# Altium project RP2040KB Rev B.PrjPcb
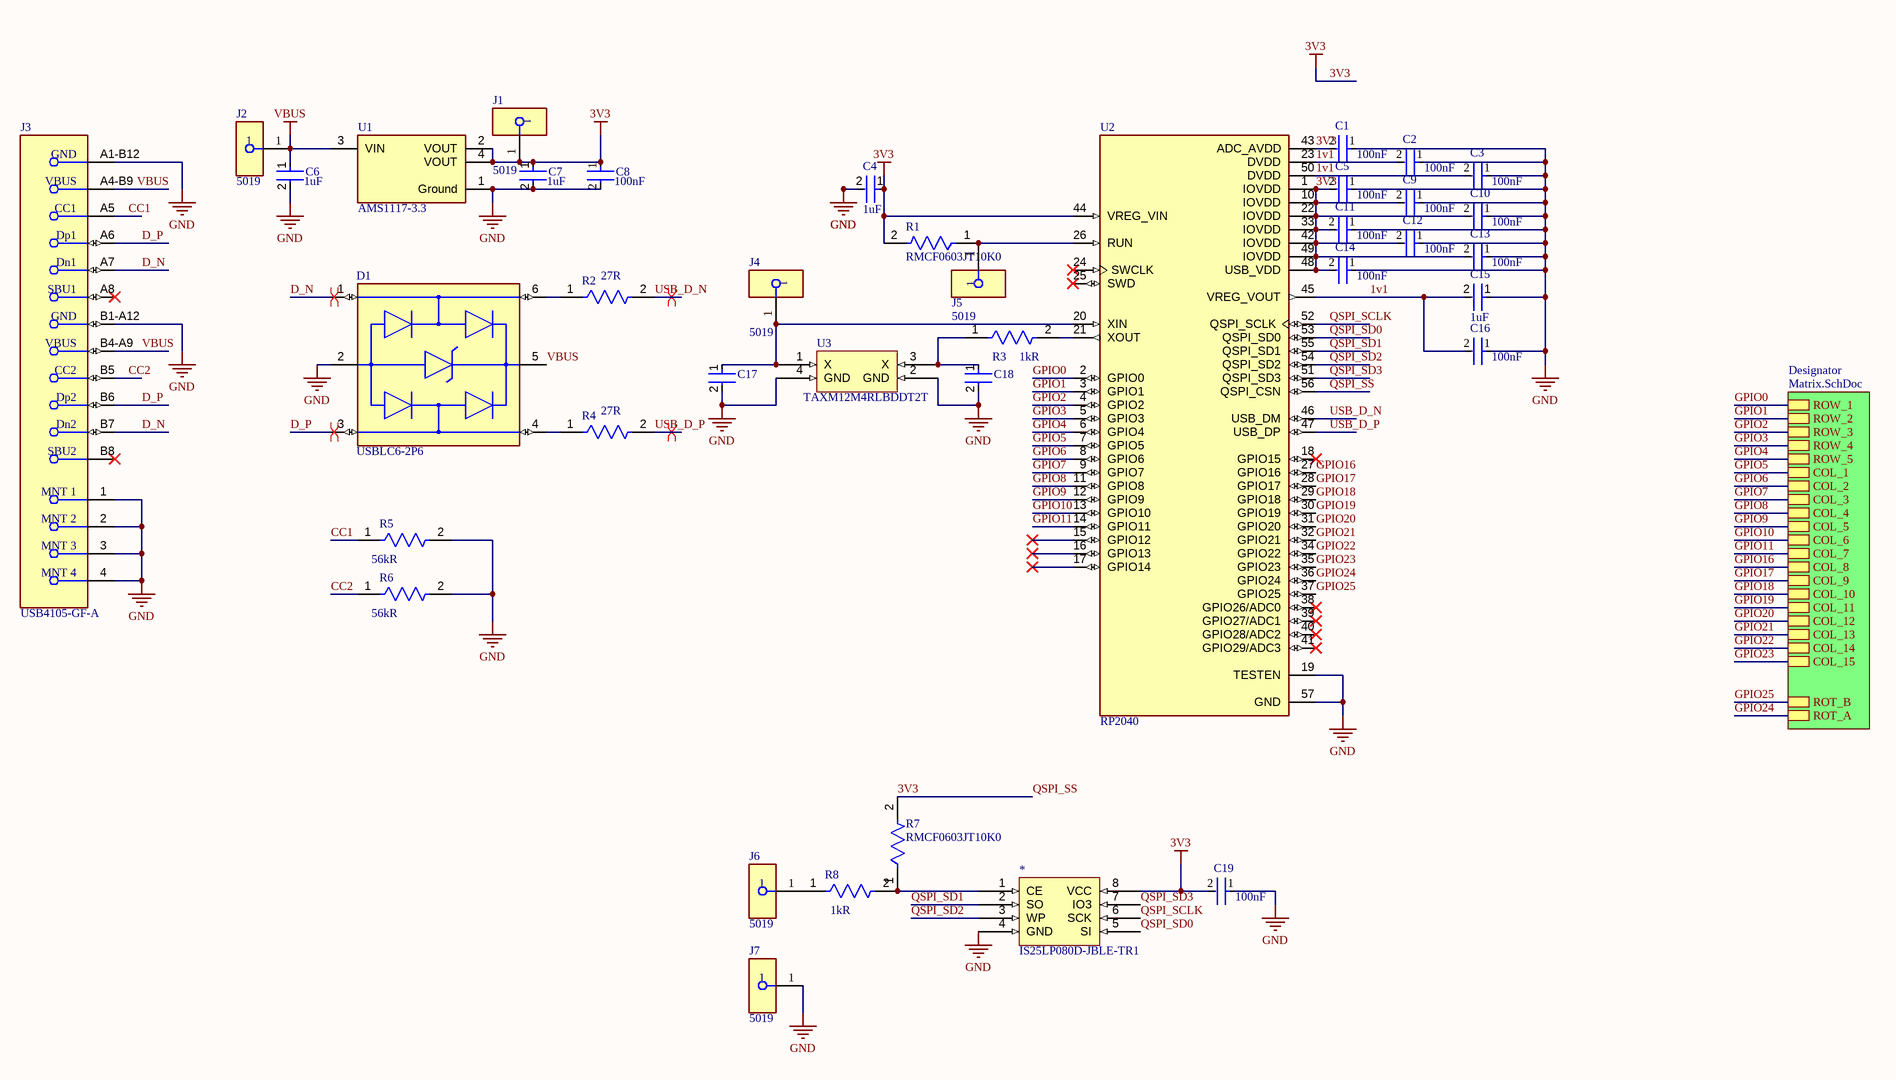
[diagram p0: Keyboard.SchDoc]
2 sheets, 179 parts. Net scope: hierarchical (ports join the sheet entries above them; power ports are global).
Board file: Layout.PcbDoc
Sheets:
  Keyboard.SchDoc
    Designator = Matrix.SchDoc

## Sheet Keyboard.SchDoc
size 431 x 279 mm; SheetNumber: 1; SheetTotal: 1

### Parts
*  IS25LP080D-JBLE-TR1  [SOIC127P1030X265-8N]
C1  Capacitance: 100nF  [FP-GRM155-0_05-MFG]  (hidden comment: GRM155R71C104KA88J)
C2  Capacitance: 100nF  [FP-GRM155-0_05-MFG]  (hidden comment: GRM155R71C104KA88J)
C3  Capacitance: 100nF  [FP-GRM155-0_05-MFG]  (hidden comment: GRM155R71C104KA88J)
C4  Capacitance: 1uF  [FP-CL10-IPC_A]  (hidden comment: CL10A105KO8NNNC)
C5  Capacitance: 100nF  [FP-GRM155-0_05-MFG]  (hidden comment: GRM155R71C104KA88J)
C6  Capacitance: 1uF  [FP-CL10-IPC_A]  (hidden comment: CL10A105KO8NNNC)
C7  Capacitance: 1uF  [FP-CL10-IPC_A]  (hidden comment: CL10A105KO8NNNC)
C8  Capacitance: 100nF  [FP-GRM155-0_05-MFG]  (hidden comment: GRM155R71C104KA88J)
C9  Capacitance: 100nF  [FP-GRM155-0_05-MFG]  (hidden comment: GRM155R71C104KA88J)
C10  Capacitance: 100nF  [FP-GRM155-0_05-MFG]  (hidden comment: GRM155R71C104KA88J)
C11  Capacitance: 100nF  [FP-GRM155-0_05-MFG]  (hidden comment: GRM155R71C104KA88J)
C12  Capacitance: 100nF  [FP-GRM155-0_05-MFG]  (hidden comment: GRM155R71C104KA88J)
C13  Capacitance: 100nF  [FP-GRM155-0_05-MFG]  (hidden comment: GRM155R71C104KA88J)
C14  Capacitance: 100nF  [FP-GRM155-0_05-MFG]  (hidden comment: GRM155R71C104KA88J)
C15  Capacitance: 1uF  [FP-CL10-IPC_A]  (hidden comment: CL10A105KO8NNNC)
C16  Capacitance: 100nF  [FP-GRM155-0_05-MFG]  (hidden comment: GRM155R71C104KA88J)
C17  GQM2195C2E320JB12D  [FP-GQM219-0_15-IPC_C]  (value not drawn)
C18  GQM2195C2E320JB12D  [FP-GQM219-0_15-IPC_C]  (value not drawn)
C19  Capacitance: 100nF  [FP-GRM155-0_05-MFG]  (hidden comment: GRM155R71C104KA88J)
D1  USBLC6-2P6  [FP-SOT-666-MFG]
J1  5019  [FP-5019-MFG]
J2  5019  [FP-5019-MFG]
J3  USB4105-GF-A  [FP-USB4105-GF-A-MFG]
J4  5019  [FP-5019-MFG]
J5  5019  [FP-5019-MFG]
J6  5019  [FP-5019-MFG]
J7  5019  [FP-5019-MFG]
R1  RMCF0603JT10K0  [FP-RMCF0603-IPC_C]
R2  Resistance: 27R  [FP-RMCF0603-IPC_B]  (hidden comment: RMCF0603FT27R0)
R3  Resistance: 1kR  [FP-RC0603-0_55-IPC_C]  (hidden comment: RC0603FR-071KL)
R4  Resistance: 27R  [FP-RMCF0603-IPC_B]  (hidden comment: RMCF0603FT27R0)
R5  Resistance: 56kR  [FP-RMCF1206-MFG]  (hidden comment: RMCF1206JT56K0)
R6  Resistance: 56kR  [FP-RMCF1206-MFG]  (hidden comment: RMCF1206JT56K0)
R7  RMCF0603JT10K0  [FP-RMCF0603-IPC_C]
R8  Resistance: 1kR  [FP-RC0603-0_55-IPC_C]  (hidden comment: RC0603FR-071KL)
U1  AMS1117-3.3  [FP-AMS1117-IPC_C]
U2  RP2040  [QFN40P700X700X90-57N]
U3  TAXM12M4RLBDDT2T  [TAXM12M4RLBDDT2T]

### Sub-sheets
Designator = Matrix.SchDoc: ROW_1, ROW_2, ROW_3, ROW_4, ROW_5, COL_1, COL_2, COL_3, COL_4, COL_5, COL_6, COL_7, COL_8, COL_9, COL_10, COL_11, COL_12, COL_13, COL_14, COL_15, ROT_B, ROT_A

### Nets
3V3: *.8(VCC) C1.2 C4.1 C5.2 C7.1 C8.1 C9.2 C10.2 C11.2 C12.2 C13.2 C14.2 C19.2 J1.1 R1.2 R7.2 U1.2(VOUT) U1.4(VOUT) U2.1(IOVDD) U2.10(IOVDD) U2.22(IOVDD) U2.33(IOVDD) U2.42(IOVDD) U2.43(ADC_AVDD) U2.44(VREG_VIN) U2.48(USB_VDD) U2.49(IOVDD) U2.56(QSPI_CSN)  [also labelled QSPI_SS]
GND: *.4(GND) C1.1 C2.1 C3.1 C4.2 C5.1 C6.2 C7.2 C8.2 C9.1 C10.1 C11.1 C12.1 C13.1 C14.1 C15.1 C16.1 C17.2 C18.2 C19.1 D1.2(GND) J3.1(MNT_1) J3.2(MNT_2) J3.3(MNT_3) J3.4(MNT_4) J3.A1-B12(GND) J3.B1-A12(GND) J7.1 R5.2 R6.2 U1.1(Ground) U2.19(TESTEN) U2.57(GND) U3.2(GND) U3.4(GND)
VBUS: C6.1 D1.5(VBUS) J2.1 J3.A4-B9(VBUS) J3.B4-A9(VBUS) U1.3(VIN)
1v1: C2.2 C3.2 C15.2 C16.2 U2.23(DVDD) U2.45(VREG_VOUT) U2.50(DVDD)
CC1: J3.A5(CC1) R5.1
CC2: J3.B5(CC2) R6.1
D_N: D1.1(I/O1) J3.A7(Dn1) J3.B7(Dn2)
D_P: D1.3(I/O2) J3.A6(Dp1) J3.B6(Dp2)
GPIO0: U2.2(GPIO0) ; sheet Designator/ROW_1
GPIO1: U2.3(GPIO1) ; sheet Designator/ROW_2
GPIO2: U2.4(GPIO2) ; sheet Designator/ROW_3
GPIO3: U2.5(GPIO3) ; sheet Designator/ROW_4
GPIO4: U2.6(GPIO4) ; sheet Designator/ROW_5
GPIO5: U2.7(GPIO5) ; sheet Designator/COL_1
GPIO6: U2.8(GPIO6) ; sheet Designator/COL_2
GPIO7: U2.9(GPIO7) ; sheet Designator/COL_3
GPIO8: U2.11(GPIO8) ; sheet Designator/COL_4
GPIO9: U2.12(GPIO9) ; sheet Designator/COL_5
GPIO10: U2.13(GPIO10) ; sheet Designator/COL_6
GPIO11: U2.14(GPIO11) ; sheet Designator/COL_7
GPIO16: U2.27(GPIO16) ; sheet Designator/COL_8
GPIO17: U2.28(GPIO17) ; sheet Designator/COL_9
GPIO18: U2.29(GPIO18) ; sheet Designator/COL_10
GPIO19: U2.30(GPIO19) ; sheet Designator/COL_11
GPIO20: U2.31(GPIO20) ; sheet Designator/COL_12
GPIO21: U2.32(GPIO21) ; sheet Designator/COL_13
GPIO22: U2.34(GPIO22) ; sheet Designator/COL_14
GPIO23: U2.35(GPIO23) ; sheet Designator/COL_15  [project net COL_15]
GPIO24: U2.36(GPIO24) ; sheet Designator/ROT_A
GPIO25: U2.37(GPIO25) ; sheet Designator/ROT_B
QSPI_SCLK: *.6(SCK) U2.52(QSPI_SCLK)
QSPI_SD0: *.5(SI) U2.53(QSPI_SD0)
QSPI_SD1: *.2(SO) U2.55(QSPI_SD1)
QSPI_SD2: *.3(WP) U2.54(QSPI_SD2)
QSPI_SD3: *.7(IO3) U2.51(QSPI_SD3)
USB_D_N: R2.2 U2.46(USB_DM)
USB_D_P: R4.2 U2.47(USB_DP)
Net*_1: *.1(CE) R7.1 R8.2
NetC17_1: C17.1 J4.1 U2.20(XIN) U3.1(X)
NetC18_1: C18.1 R3.1 U3.3(X)
NetD1_4: D1.4(I/O2) R4.1
NetD1_6: D1.6(I/O1) R2.1
NetJ5_1: J5.1 R1.1 U2.26(RUN)
NetJ6_1: J6.1 R8.1
NetR3_2: R3.2 U2.21(XOUT)

Not connected (* = marked no-connect by the designer): J3 A8(SBU1)* B8(SBU2)*; U2 15(GPIO12)* 16(GPIO13)* 17(GPIO14)* 18(GPIO15)* 24(SWCLK)* 25(SWD)* 38(GPIO26/ADC0)* 39(GPIO27/ADC1)* 40(GPIO28/ADC2)* 41(GPIO29/ADC3)*

### Layout directives
differential pair: D_N, D_P, USB_D_N, USB_D_P

### Notes on the sheet
- DWG. NO.
- REV.
- SHT.
- THIS DOCUMENT AND THE DATA DISCLOSED HEREIN OR HEREWITH IS THE PROPERTY OF ALTIUM LIMITED AND MAY BE FREELY DISTRIBUTED IN WHOLE. NO RIGHTS ARE RESERVED OR EXPRESS OR IMPLIED WARANTEE GIVEN.
- REVISION
- DESCRIPTION
- DATE
- APPROVED
- ENG:
- APPROVALS
- PROJECT
- DSN:
- CHK:
- REFERENCE DOCUMENTS
- PROJECT REVISION:
- TITLE
- DOCUMENT REVISION:
- DESIGN ITEM:
- BOM:
- FAB DWG:
- PCB DWG:
- ASSY DWG:
- SCALE:
- SIZE
- B
- CAGE CODE
- FILE NAME
- DWG NO.
- SHEET
- OF
- REV

### Library data of the parts
* = CMP-002-00077-1: Flash
C1-C3 C5 C8-C14 C16 C19 = CMP-2008-03928-2: NexarPartId: 9223238; Manufacturer Lifecycle Status: NRND; Voltage: 16V; Tolerance: 10%; Dielectric: X7R; Material: Ceramic; Schedule B: 8532240020, 8532240020; Mount: Surface Mount; Case/Package: 0402; Case Code (Imperial): 0402; Min Operating Temperature: -55°C; Length: 1mm; Voltage Rating (DC): 16V; Depth: 500µm; Lead Free: Lead Free; Max Operating Temperature: 125°C; Case Code (Metric): 1005; Radiation Hardening: No; Height: 550µm; Voltage Rating: 16V; Packaging: Cut Tape; RoHS: Compliant; Width: 500µm; Number of Pins: 2; REACH SVHC: No SVHC; Termination: SMD/SMT; Thickness: 500µm
C4 C6 C7 C15 = CMP-13271-001457-1: Cap Ceramic 1uF 16V X5R ±10% Pad SMD 0603 +85°C T/R; Dielectric: X5R; Height: 0.8mm; Mount: Surface Mount; Thickness: 0.035inch; Width: 0.031inch; Min Operating Temperature: -55°C; Contact Plating: Tin; Case Code (Imperial): 0603; Depth: 0.8mm; Length: 1.6mm; Max Operating Temperature: 85°C; Packaging: Tape and Reel; Tolerance: 10%; Radiation Hardening: No; Case/Package: 0603; Package Quantity: 1; Voltage Rating: 16V; Case Code (Metric): 1608; Voltage: 16V; Material: Ceramic; Lead Free: Lead Free; Voltage Rating (DC): 16V
C17 C18 = CMP-06035-016346-1: Ceramic Capacitor 32pF ±5% 250VDC C0G 0805 Paper T/R
D1 = CMP-12225-000058-1: TVS DIODE 5.25V 17V SOT666; Min Breakdown Voltage: 6V; Power Line Protection: Yes; Element Configuration: Dual; Test Current: 1mA; Working Voltage: 5V; Number of Channels: 2; Max Reverse Leakage Current: 150nA; Direction: Unidirectional; Peak Pulse Current: 5A; Number of Elements: 1; Capacitance: 3.5pF; Max Breakdown Voltage: 6V; Height: 0.6mm; Depth: 1.3mm; Contact Plating: Tin; Reverse Breakdown Voltage: 6V; REACH SVHC: No SVHC; Operating Supply Voltage: 5V; Width: 1.3mm; Max Operating Temperature: 125°C; Reverse Standoff Voltage: 5V; ESD Protection: Yes; Package Quantity: 1; Termination: SMD/SMT; Length: 1.7mm; Leakage Current: 150nA; Number of Bidirectional Channels: 2; Case/Package: SOT-666; Min Operating Temperature: -40°C; Number of Pins: 6; Clamping Voltage: 17V; Breakdown Voltage: 6V; Lead Free: Lead Free; Radiation Hardening: No; Packaging: Tape and Reel; Mount: Surface Mount; Polarity: Unidirectional
J1 J2 J4-J7 = CMP-1672-00008-2: NexarPartId: 22052288; Number of Contacts: 1; Contact Material: Bronze, Silver; Number of Pins: 1; Lead Free: Lead Free; Packaging: Tape and Reel; Mount: Surface Mount; Height: 2.286mm; Contact Plating: Silver; Material: Bronze; Termination: SMD/SMT; REACH SVHC: No SVHC; RoHS: Compliant
J3 = CMP-245163-000001-1: CONN RCPT USB2.0 TYPEC 5A; Manufacturer: GCT; Voltage Rating: 20V; Is Female: yes; Current Rating: 5/6.25/1.25/0.25A; Number Of Contacts: 16; Conn Orientation: Right Angle; Device Class L1: Connectors; Category: Conn; Lead Free: Yes; RoHS: TRUE; Temperature Range High: +85°C; Digikey Description: CONN RCPT USB2.0 TYPEC 5A; Device Class L3: unset; ComponentLink2Description: Datasheet; Manufacturer Part Number: USB4105-GF-A; Package: 0; Usb Standard: USB 2.0; Device Class L2: USB Connectors; Automotive: No; Temperature Range Low: -40°C; Height: 3.46mm; Temperature: -40°C to +85°C; Contact Material: Gold,Nickel; ComponentLink2URL: https://gct.co/files/drawings/usb4105.pdf; Octopart: https://octopart.com/usb4105-gf-a-gct-106627878
R1 R7 = CMP-26527-002098-1: 10kΩ ±5% 0.1W 0603 Thick Film Chip Resistor AEC-Q200 compliant; Power Rating: 100mW; Temperature Coefficient: 100ppm/°C; Resistance: 10kR; Radiation Hardening: No; Military Standard: Not; Mount: Surface Mount; Resistor Type: Thick Film; Size Code: 0603; Case/Package: 0603; Min Operating Temperature: -55°C; Construction: Rectangular; Series: RMCF; Width: 0.031inch; Length: 1.55mm; Case Code (Metric): 1608; Depth: 0.8mm; Height: 0.022inch; Packaging: Tape and Reel; Lead Free: Lead Free; Tolerance: 5%; Case Code (Imperial): 0603; Max Operating Temperature: 155°C; Contact Plating: Tin; Max Power Dissipation: 100mW; Features: Automotive AEC-Q200; Number of Terminations: 2
R2 R4 = CMP-26527-005743-1: 27Ω ±1% 0.1W 0603 Thick Film Chip Resistor AEC-Q200 compliant; Max Power Dissipation: 100mW; Temperature Coefficient: 100ppm/°C; Case/Package: 0603; Contact Plating: Tin; Packaging: Tape and Reel; Length: 0.061inch; Radiation Hardening: No; Mount: Surface Mount; Series: RMCF; Min Operating Temperature: -55°C; Lead Free: Lead Free; Width: 0.031inch; Resistor Type: Thick Film; Max Operating Temperature: 155°C; RoHS Compliant: Yes; Case Code (Imperial): 0603; Height: 0.022inch; Number of Terminations: 2; Case Code (Metric): 1608; Tolerance: 1%; Features: Automotive AEC-Q200
R3 R8 = CMP-1659-00009-5: RES 1K OHM 1% 1/10W 0603; Voltage Rating: 50V; Power Rating: 100mW; Temperature Coefficient: 100ppm/°C; Military Standard: Not; REACH SVHC: No SVHC; Size Code: 0603; Features: Moisture Resistant; Number of Terminations: 2; Technology: THICK FILM; Series: RC; Case Code (Metric): 1608; Resistance Tolerance: 1%; Resistor Type: Thick Film; Termination: SMD/SMT; Contact Plating: Tin; Radiation Hardening: No; Min Operating Temperature: -55°C; Max Operating Temperature: 155°C; Packaging: Tape and Reel; Max Power Dissipation: 100mW; RoHS Compliant: Yes; Height: 0.45mm; Lead Free: Lead Free; Case/Package: 0603; Length: 1.6mm; Tolerance: 1%; Case Code (Imperial): 0603; Construction: Rectangular; Depth: 0.8mm
R5 R6 = CMP-26527-003341-1: 56kΩ ±5% 0.25W 1206 Thick Film Chip Resistor AEC-Q200 compliant; Max Power Dissipation: 250mW; Temperature Coefficient: 200ppm/°C; RoHS Compliant: Yes; Number of Terminations: 2; Max Operating Temperature: 155°C; Case/Package: 1206; Case Code (Imperial): 1206; Length: 0.126inch; Size Code: 1206; Height: 0.028inch; Resistor Type: Thick Film; Width: 0.063inch; Power Rating: 250mW; Contact Plating: Tin; Min Operating Temperature: -55°C; Features: Automotive AEC-Q200; Military Standard: Not; Mount: Surface Mount; Depth: 1.6mm; Tolerance: 5%; Lead Free: Lead Free; Packaging: Tape and Reel; Construction: Rectangular; Radiation Hardening: No; Case Code (Metric): 3216; Series: RMCF
U1 = CMP-209535-000001-1: LDO Voltage Regulators 1A, 3.3V; Manufacturer: Advanced Monolithic Systems; Dropout Voltage: 1.1V; Output Type: Fixed; Nominal Supply Current: 5mA; Max Power Dissipation: 1.2W; Max Supply Voltage: 15V; Number Of Outputs: 1; Standoff Height: 0.64mm; Max Junction Temp: +125°C; Height: 1.8mm; Package: AMS1117; Device Class L2: Power Management ICs; ComponentLink2Description: Datasheet; ComponentLink2URL: http://www.advanced-monolithic.com/pdf/ds1117.pdf; Category: IC; RoHS: TRUE; Automotive: No; Device Class L1: Integrated Circuits (ICs); Output Current: 1A; Device Class L3: Voltage Regulators - Linear; Temperature: -40°C to +125°C; Output Voltage: 3.3V; Manufacturer Part Number: AMS1117-3.3; Temperature Range Low: -40°C; Octopart: https://octopart.com/ams1117-3.3-advanced+monolithic+systems-25899300; Lead Free: Yes; Ipc Land Pattern Name: SOT229P700X180-4; Temperature Range High: +125°C
U2 = CMP-027-000000-1: RP2040 chip for Raspberry Pi Pico - ARM® Cortex®-M0+ MCU 32-Bit; MP: RP2040; Design Item ID: RP2040; SnapEDA_Link: https://www.snapeda.com/parts/RP2040/Raspberry+Pi/view-part/?ref=snap; Source: RP2040.SchLib; Pin Count: 57; Value: *; Component Type: Standard; MF: Raspberry Pi; Package: None; Check_prices: https://www.snapeda.com/parts/RP2040/Raspberry+Pi/view-part/?ref=eda
U3 = CMP-00000-1: Crystal 12MHz; Load Capacitance: 20pF; Frequency: 12MHz

## Sheet Matrix.SchDoc
size 431 x 279 mm; SheetNumber: 2; SheetTotal: 2
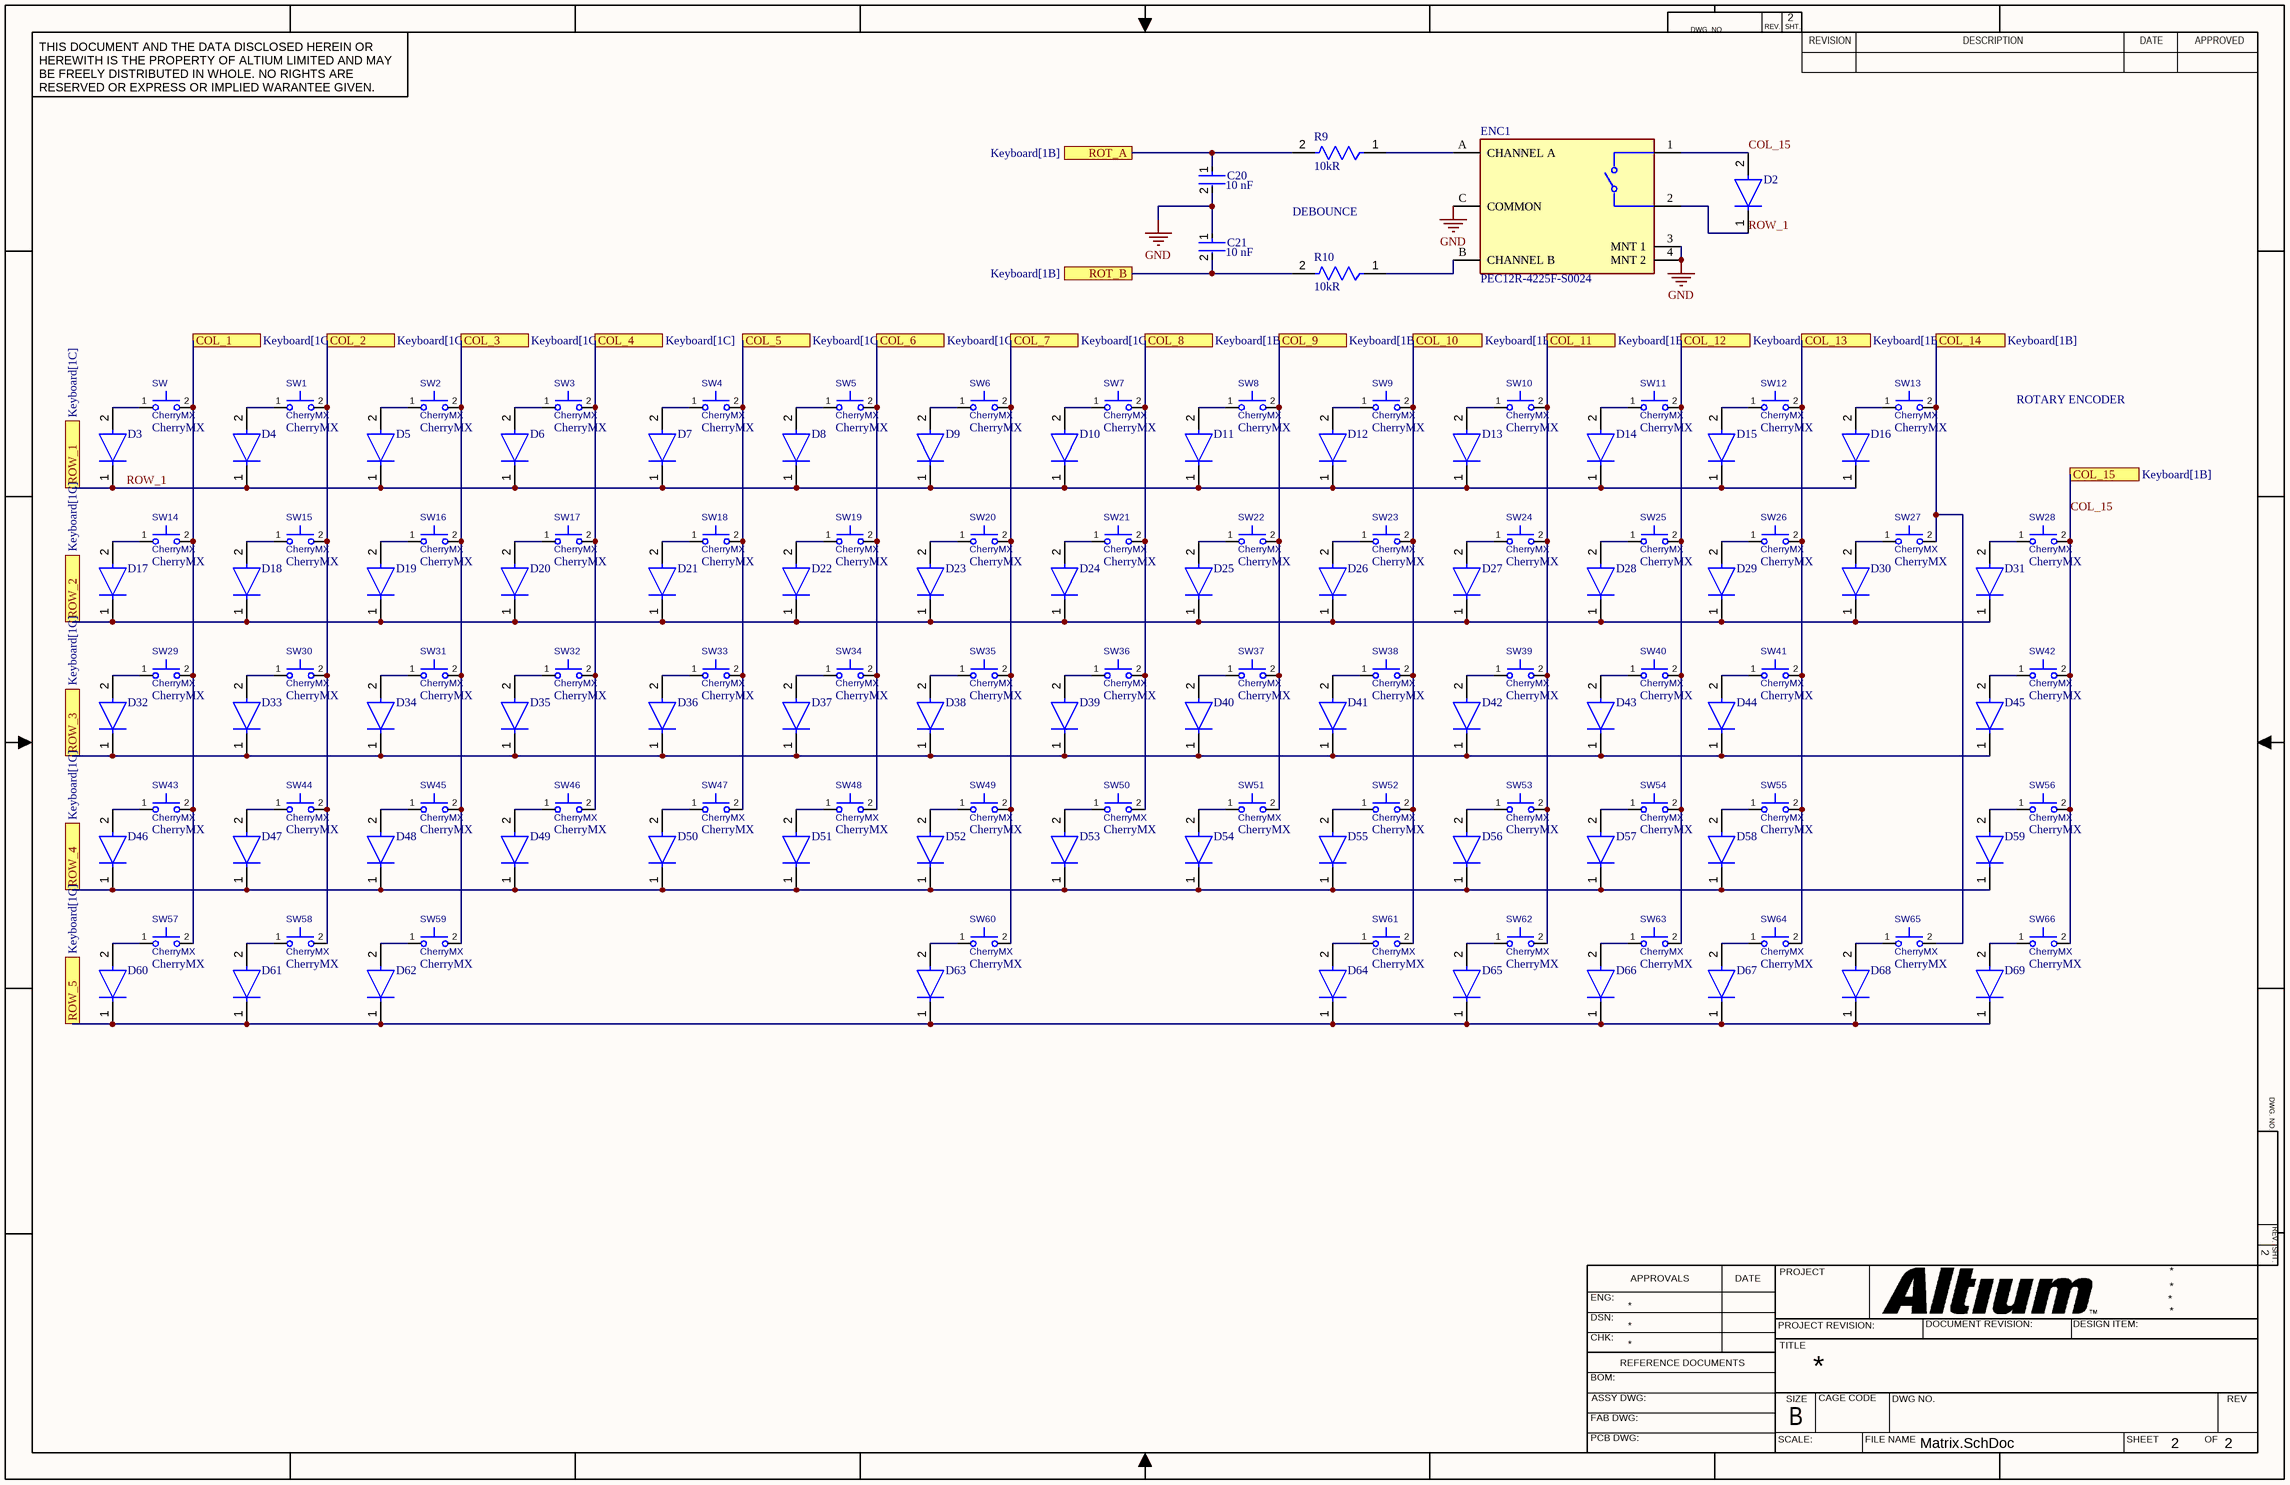
[diagram p1: Matrix.SchDoc]

### Parts
C20  Capacitance: 10 nF  [FP-CC0603-DA-MFG]  (hidden comment: CC0603KRX7R9BB103)
C21  Capacitance: 10 nF  [FP-CC0603-DA-MFG]  (hidden comment: CC0603KRX7R9BB103)
D2  1N4148W-TP  [FP-SOD-123-IPC_A]  (value not drawn)
D3  1N4148W-TP  [FP-SOD-123-IPC_A]  (value not drawn)
D4  1N4148W-TP  [FP-SOD-123-IPC_A]  (value not drawn)
D5  1N4148W-TP  [FP-SOD-123-IPC_A]  (value not drawn)
D6  1N4148W-TP  [FP-SOD-123-IPC_A]  (value not drawn)
D7  1N4148W-TP  [FP-SOD-123-IPC_A]  (value not drawn)
D8  1N4148W-TP  [FP-SOD-123-IPC_A]  (value not drawn)
D9  1N4148W-TP  [FP-SOD-123-IPC_A]  (value not drawn)
D10  1N4148W-TP  [FP-SOD-123-IPC_A]  (value not drawn)
D11  1N4148W-TP  [FP-SOD-123-IPC_A]  (value not drawn)
D12  1N4148W-TP  [FP-SOD-123-IPC_A]  (value not drawn)
D13  1N4148W-TP  [FP-SOD-123-IPC_A]  (value not drawn)
D14  1N4148W-TP  [FP-SOD-123-IPC_A]  (value not drawn)
D15  1N4148W-TP  [FP-SOD-123-IPC_A]  (value not drawn)
D16  1N4148W-TP  [FP-SOD-123-IPC_A]  (value not drawn)
D17  1N4148W-TP  [FP-SOD-123-IPC_A]  (value not drawn)
D18  1N4148W-TP  [FP-SOD-123-IPC_A]  (value not drawn)
D19  1N4148W-TP  [FP-SOD-123-IPC_A]  (value not drawn)
D20  1N4148W-TP  [FP-SOD-123-IPC_A]  (value not drawn)
D21  1N4148W-TP  [FP-SOD-123-IPC_A]  (value not drawn)
D22  1N4148W-TP  [FP-SOD-123-IPC_A]  (value not drawn)
D23  1N4148W-TP  [FP-SOD-123-IPC_A]  (value not drawn)
D24  1N4148W-TP  [FP-SOD-123-IPC_A]  (value not drawn)
D25  1N4148W-TP  [FP-SOD-123-IPC_A]  (value not drawn)
D26  1N4148W-TP  [FP-SOD-123-IPC_A]  (value not drawn)
D27  1N4148W-TP  [FP-SOD-123-IPC_A]  (value not drawn)
D28  1N4148W-TP  [FP-SOD-123-IPC_A]  (value not drawn)
D29  1N4148W-TP  [FP-SOD-123-IPC_A]  (value not drawn)
D30  1N4148W-TP  [FP-SOD-123-IPC_A]  (value not drawn)
D31  1N4148W-TP  [FP-SOD-123-IPC_A]  (value not drawn)
D32  1N4148W-TP  [FP-SOD-123-IPC_A]  (value not drawn)
D33  1N4148W-TP  [FP-SOD-123-IPC_A]  (value not drawn)
D34  1N4148W-TP  [FP-SOD-123-IPC_A]  (value not drawn)
D35  1N4148W-TP  [FP-SOD-123-IPC_A]  (value not drawn)
D36  1N4148W-TP  [FP-SOD-123-IPC_A]  (value not drawn)
D37  1N4148W-TP  [FP-SOD-123-IPC_A]  (value not drawn)
D38  1N4148W-TP  [FP-SOD-123-IPC_A]  (value not drawn)
D39  1N4148W-TP  [FP-SOD-123-IPC_A]  (value not drawn)
D40  1N4148W-TP  [FP-SOD-123-IPC_A]  (value not drawn)
D41  1N4148W-TP  [FP-SOD-123-IPC_A]  (value not drawn)
D42  1N4148W-TP  [FP-SOD-123-IPC_A]  (value not drawn)
D43  1N4148W-TP  [FP-SOD-123-IPC_A]  (value not drawn)
D44  1N4148W-TP  [FP-SOD-123-IPC_A]  (value not drawn)
D45  1N4148W-TP  [FP-SOD-123-IPC_A]  (value not drawn)
D46  1N4148W-TP  [FP-SOD-123-IPC_A]  (value not drawn)
D47  1N4148W-TP  [FP-SOD-123-IPC_A]  (value not drawn)
D48  1N4148W-TP  [FP-SOD-123-IPC_A]  (value not drawn)
D49  1N4148W-TP  [FP-SOD-123-IPC_A]  (value not drawn)
D50  1N4148W-TP  [FP-SOD-123-IPC_A]  (value not drawn)
D51  1N4148W-TP  [FP-SOD-123-IPC_A]  (value not drawn)
D52  1N4148W-TP  [FP-SOD-123-IPC_A]  (value not drawn)
D53  1N4148W-TP  [FP-SOD-123-IPC_A]  (value not drawn)
D54  1N4148W-TP  [FP-SOD-123-IPC_A]  (value not drawn)
D55  1N4148W-TP  [FP-SOD-123-IPC_A]  (value not drawn)
D56  1N4148W-TP  [FP-SOD-123-IPC_A]  (value not drawn)
D57  1N4148W-TP  [FP-SOD-123-IPC_A]  (value not drawn)
D58  1N4148W-TP  [FP-SOD-123-IPC_A]  (value not drawn)
D59  1N4148W-TP  [FP-SOD-123-IPC_A]  (value not drawn)
D60  1N4148W-TP  [FP-SOD-123-IPC_A]  (value not drawn)
D61  1N4148W-TP  [FP-SOD-123-IPC_A]  (value not drawn)
D62  1N4148W-TP  [FP-SOD-123-IPC_A]  (value not drawn)
D63  1N4148W-TP  [FP-SOD-123-IPC_A]  (value not drawn)
D64  1N4148W-TP  [FP-SOD-123-IPC_A]  (value not drawn)
D65  1N4148W-TP  [FP-SOD-123-IPC_A]  (value not drawn)
D66  1N4148W-TP  [FP-SOD-123-IPC_A]  (value not drawn)
D67  1N4148W-TP  [FP-SOD-123-IPC_A]  (value not drawn)
D68  1N4148W-TP  [FP-SOD-123-IPC_A]  (value not drawn)
D69  1N4148W-TP  [FP-SOD-123-IPC_A]  (value not drawn)
ENC1  PEC12R-4225F-S0024  [FP-PEC12R-4225F-S0024-MFG]
R9  Resistance: 10kR  [FP-RC0402-0_4-IPC_C]  (hidden comment: RC0402JR-0710KL)
R10  Resistance: 10kR  [FP-RC0402-0_4-IPC_C]  (hidden comment: RC0402JR-0710KL)
SW  CherryMX  [CherryMX-Footprint-1]
SW1  CherryMX  [CherryMX-Footprint-1]
SW2  CherryMX  [CherryMX-Footprint-1]
SW3  CherryMX  [CherryMX-Footprint-1]
SW4  CherryMX  [CherryMX-Footprint-1]
SW5  CherryMX  [CherryMX-Footprint-1]
SW6  CherryMX  [CherryMX-Footprint-1]
SW7  CherryMX  [CherryMX-Footprint-1]
SW8  CherryMX  [CherryMX-Footprint-1]
SW9  CherryMX  [CherryMX-Footprint-1]
SW10  CherryMX  [CherryMX-Footprint-1]
SW11  CherryMX  [CherryMX-Footprint-1]
SW12  CherryMX  [CherryMX-Footprint-1]
SW13  CherryMX  [CherryMX-Footprint-1]
SW14  CherryMX  [CherryMX-Footprint-1]
SW15  CherryMX  [CherryMX-Footprint-1]
SW16  CherryMX  [CherryMX-Footprint-1]
SW17  CherryMX  [CherryMX-Footprint-1]
SW18  CherryMX  [CherryMX-Footprint-1]
SW19  CherryMX  [CherryMX-Footprint-1]
SW20  CherryMX  [CherryMX-Footprint-1]
SW21  CherryMX  [CherryMX-Footprint-1]
SW22  CherryMX  [CherryMX-Footprint-1]
SW23  CherryMX  [CherryMX-Footprint-1]
SW24  CherryMX  [CherryMX-Footprint-1]
SW25  CherryMX  [CherryMX-Footprint-1]
SW26  CherryMX  [CherryMX-Footprint-1]
SW27  CherryMX  [CherryMX-Footprint-1]
SW28  CherryMX  [CherryMX-Footprint-1]
SW29  CherryMX  [CherryMX-Footprint-1]
SW30  CherryMX  [CherryMX-Footprint-1]
SW31  CherryMX  [CherryMX-Footprint-1]
SW32  CherryMX  [CherryMX-Footprint-1]
SW33  CherryMX  [CherryMX-Footprint-1]
SW34  CherryMX  [CherryMX-Footprint-1]
SW35  CherryMX  [CherryMX-Footprint-1]
SW36  CherryMX  [CherryMX-Footprint-1]
SW37  CherryMX  [CherryMX-Footprint-1]
SW38  CherryMX  [CherryMX-Footprint-1]
SW39  CherryMX  [CherryMX-Footprint-1]
SW40  CherryMX  [CherryMX-Footprint-1]
SW41  CherryMX  [CherryMX-Footprint-1]
SW42  CherryMX  [CherryMX-Footprint-1]
SW43  CherryMX  [CherryMX-Footprint-1]
SW44  CherryMX  [CherryMX-Footprint-1]
SW45  CherryMX  [CherryMX-Footprint-1]
SW46  CherryMX  [CherryMX-Footprint-1]
SW47  CherryMX  [CherryMX-Footprint-1]
SW48  CherryMX  [CherryMX-Footprint-1]
SW49  CherryMX  [CherryMX-Footprint-1]
SW50  CherryMX  [CherryMX-Footprint-1]
SW51  CherryMX  [CherryMX-Footprint-1]
SW52  CherryMX  [CherryMX-Footprint-1]
SW53  CherryMX  [CherryMX-Footprint-1]
SW54  CherryMX  [CherryMX-Footprint-1]
SW55  CherryMX  [CherryMX-Footprint-1]
SW56  CherryMX  [CherryMX-Footprint-1]
SW57  CherryMX  [CherryMX-Footprint-1]
SW58  CherryMX  [CherryMX-Footprint-1]
SW59  CherryMX  [CherryMX-Footprint-1]
SW60  CherryMX  [CherryMX-Footprint-1]
SW61  CherryMX  [CherryMX-Footprint-1]
SW62  CherryMX  [CherryMX-Footprint-1]
SW63  CherryMX  [CherryMX-Footprint-1]
SW64  CherryMX  [CherryMX-Footprint-1]
SW65  CherryMX  [CherryMX-Footprint-1]
SW66  CherryMX  [CherryMX-Footprint-1]

### Ports
COL_1 (see Keyboard[1C]), COL_2 (see Keyboard[1C]), COL_3 (see Keyboard[1C]), COL_4 (see Keyboard[1C]), COL_5 (see Keyboard[1C]), COL_6 (see Keyboard[1C]), COL_7 (see Keyboard[1C]), COL_8 (see Keyboard[1B]), COL_9 (see Keyboard[1B]), COL_10 (see Keyboard[1B]), COL_11 (see Keyboard[1B]), COL_12 (see Keyboard[1B]), COL_13 (see Keyboard[1B]), COL_14 (see Keyboard[1B]), COL_15 (see Keyboard[1B]), ROT_A (see Keyboard[1B]), ROT_B (see Keyboard[1B]), ROW_1 (see Keyboard[1C]), ROW_2 (see Keyboard[1C]), ROW_3 (see Keyboard[1C]), ROW_4 (see Keyboard[1C]), ROW_5 (see Keyboard[1C])

### Nets
GND: C20.2 C21.1 ENC1.3(MNT_1) ENC1.4(MNT_2) ENC1.C(COMMON)
COL_15: D2.2(A) ENC1.1 SW28.2 SW42.2 SW56.2 SW66.2 ; port COL_15
GPIO1: D17.1(C) D18.1(C) D19.1(C) D20.1(C) D21.1(C) D22.1(C) D23.1(C) D24.1(C) D25.1(C) D26.1(C) D27.1(C) D28.1(C) D29.1(C) D30.1(C) D31.1(C) ; port ROW_2
GPIO2: D32.1(C) D33.1(C) D34.1(C) D35.1(C) D36.1(C) D37.1(C) D38.1(C) D39.1(C) D40.1(C) D41.1(C) D42.1(C) D43.1(C) D44.1(C) D45.1(C) ; port ROW_3
GPIO3: D46.1(C) D47.1(C) D48.1(C) D49.1(C) D50.1(C) D51.1(C) D52.1(C) D53.1(C) D54.1(C) D55.1(C) D56.1(C) D57.1(C) D58.1(C) D59.1(C) ; port ROW_4
GPIO4: D60.1(C) D61.1(C) D62.1(C) D63.1(C) D64.1(C) D65.1(C) D66.1(C) D67.1(C) D68.1(C) D69.1(C) ; port ROW_5
GPIO5: SW.2 SW14.2 SW29.2 SW43.2 SW57.2 ; port COL_1
GPIO6: SW1.2 SW15.2 SW30.2 SW44.2 SW58.2 ; port COL_2
GPIO7: SW2.2 SW16.2 SW31.2 SW45.2 SW59.2 ; port COL_3
GPIO8: SW3.2 SW17.2 SW32.2 SW46.2 ; port COL_4
GPIO9: SW4.2 SW18.2 SW33.2 SW47.2 ; port COL_5
GPIO10: SW5.2 SW19.2 SW34.2 SW48.2 ; port COL_6
GPIO11: SW6.2 SW20.2 SW35.2 SW49.2 SW60.2 ; port COL_7
GPIO16: SW7.2 SW21.2 SW36.2 SW50.2 ; port COL_8
GPIO17: SW8.2 SW22.2 SW37.2 SW51.2 ; port COL_9
GPIO18: SW9.2 SW23.2 SW38.2 SW52.2 SW61.2 ; port COL_10
GPIO19: SW10.2 SW24.2 SW39.2 SW53.2 SW62.2 ; port COL_11
GPIO20: SW11.2 SW25.2 SW40.2 SW54.2 SW63.2 ; port COL_12
GPIO21: SW12.2 SW26.2 SW41.2 SW55.2 SW64.2 ; port COL_13
GPIO22: SW13.2 SW27.2 SW65.2 ; port COL_14
GPIO24: C20.1 R9.2 ; port ROT_A
GPIO25: C21.2 R10.2 ; port ROT_B
ROW_1: D2.1(C) D3.1(C) D4.1(C) D5.1(C) D6.1(C) D7.1(C) D8.1(C) D9.1(C) D10.1(C) D11.1(C) D12.1(C) D13.1(C) D14.1(C) D15.1(C) D16.1(C) ENC1.2 ; port ROW_1  [project net GPIO0]
NetD3_2: D3.2(A) SW.1
NetD4_2: D4.2(A) SW1.1
NetD5_2: D5.2(A) SW2.1
NetD6_2: D6.2(A) SW3.1
NetD7_2: D7.2(A) SW4.1
NetD8_2: D8.2(A) SW5.1
NetD9_2: D9.2(A) SW6.1
NetD10_2: D10.2(A) SW7.1
NetD11_2: D11.2(A) SW8.1
NetD12_2: D12.2(A) SW9.1
NetD13_2: D13.2(A) SW10.1
NetD14_2: D14.2(A) SW11.1
NetD15_2: D15.2(A) SW12.1
NetD16_2: D16.2(A) SW13.1
NetD17_2: D17.2(A) SW14.1
NetD18_2: D18.2(A) SW15.1
NetD19_2: D19.2(A) SW16.1
NetD20_2: D20.2(A) SW17.1
NetD21_2: D21.2(A) SW18.1
NetD22_2: D22.2(A) SW19.1
NetD23_2: D23.2(A) SW20.1
NetD24_2: D24.2(A) SW21.1
NetD25_2: D25.2(A) SW22.1
NetD26_2: D26.2(A) SW23.1
NetD27_2: D27.2(A) SW24.1
NetD28_2: D28.2(A) SW25.1
NetD29_2: D29.2(A) SW26.1
NetD30_2: D30.2(A) SW27.1
NetD31_2: D31.2(A) SW28.1
NetD32_2: D32.2(A) SW29.1
NetD33_2: D33.2(A) SW30.1
NetD34_2: D34.2(A) SW31.1
NetD35_2: D35.2(A) SW32.1
NetD36_2: D36.2(A) SW33.1
NetD37_2: D37.2(A) SW34.1
NetD38_2: D38.2(A) SW35.1
NetD39_2: D39.2(A) SW36.1
NetD40_2: D40.2(A) SW37.1
NetD41_2: D41.2(A) SW38.1
NetD42_2: D42.2(A) SW39.1
NetD43_2: D43.2(A) SW40.1
NetD44_2: D44.2(A) SW41.1
NetD45_2: D45.2(A) SW42.1
NetD46_2: D46.2(A) SW43.1
NetD47_2: D47.2(A) SW44.1
NetD48_2: D48.2(A) SW45.1
NetD49_2: D49.2(A) SW46.1
NetD50_2: D50.2(A) SW47.1
NetD51_2: D51.2(A) SW48.1
NetD52_2: D52.2(A) SW49.1
NetD53_2: D53.2(A) SW50.1
NetD54_2: D54.2(A) SW51.1
NetD55_2: D55.2(A) SW52.1
NetD56_2: D56.2(A) SW53.1
NetD57_2: D57.2(A) SW54.1
NetD58_2: D58.2(A) SW55.1
NetD59_2: D59.2(A) SW56.1
NetD60_2: D60.2(A) SW57.1
NetD61_2: D61.2(A) SW58.1
NetD62_2: D62.2(A) SW59.1
NetD63_2: D63.2(A) SW60.1
NetD64_2: D64.2(A) SW61.1
NetD65_2: D65.2(A) SW62.1
NetD66_2: D66.2(A) SW63.1
NetD67_2: D67.2(A) SW64.1
NetD68_2: D68.2(A) SW65.1
NetD69_2: D69.2(A) SW66.1
NetENC1_A: ENC1.A(CHANNEL_A) R9.1
NetENC1_B: ENC1.B(CHANNEL_B) R10.1

### Notes on the sheet
- DEBOUNCE
- ROTARY ENCODER
- DWG. NO.
- REV.
- SHT.
- THIS DOCUMENT AND THE DATA DISCLOSED HEREIN OR HEREWITH IS THE PROPERTY OF ALTIUM LIMITED AND MAY BE FREELY DISTRIBUTED IN WHOLE. NO RIGHTS ARE RESERVED OR EXPRESS OR IMPLIED WARANTEE GIVEN.
- REVISION
- DESCRIPTION
- DATE
- APPROVED
- ENG:
- APPROVALS
- PROJECT
- DSN:
- CHK:
- REFERENCE DOCUMENTS
- PROJECT REVISION:
- TITLE
- DOCUMENT REVISION:
- DESIGN ITEM:
- BOM:
- FAB DWG:
- PCB DWG:
- ASSY DWG:
- SCALE:
- SIZE
- B
- CAGE CODE
- FILE NAME
- DWG NO.
- SHEET
- OF
- REV

### Library data of the parts
C20 C21 = CMP-2100-03600-2: CAP CER 10000PF 50V X7R 0603; Manufacturer: YAGEO; Tolerance: 0.1; Material: Ceramic; Temperature Coefficient: 15%; Value: 10 nF; Description: CC0603 10 nF X7R 10.00% 50 V; Mouser Description: Multilayer Ceramic Capacitor, CC Series, 0.01 - F, - 10%, X7R, 50 V, 0603 [1608 Metric]; Digikey Description: CAP CER 10000PF 50V X7R 0603; Height: 0.9mm; Category: Cap; Temperature Characteristic: X7R; Footprint Url: http://www.yageo.com/exep/pages/download/literatures/UPY-C_GEN_24.pdf; Lead Free: Yes; Voltage Rating: 50 V; Manufacturer Part Number: CC0603KRX7R9BB103; Temperature: -55°C to +125°C; Device Class L3: Ceramic Capacitors; ComponentLink2Description: Datasheet; Voltage: 50 V; Package: CC0603-DA; Octopart: https://octopart.com/cc0603krx7r9bb103-yageo-192938; Automotive: No; Temperature Range High: +125°C; Temperature Range Low: -55°C; RoHS: TRUE; Device Class L1: Passive Components; ComponentLink2URL: http://www.yageo.com/documents/recent/UPY-GPHC_X7R_6.3V-to-50V_18.pdf; Device Class L2: Capacitors
D2-D69 = CMP-2000-04993-2: DIODE GEN PURP 100V 150MA SOD123; Max Reverse Leakage Current: 5uA; Max Surge Current: 2A; Reverse Recovery Time: 4ns; Polarity: Standard; Capacitance: 4pF; Max Forward Surge Current (Ifsm): 1A; Element Configuration: Single; Power Dissipation: 400mW; Forward Voltage: 1V; Radiation Hardening: No; Lead Free: Lead Free; Max Reverse Voltage (DC): 100V; Current Rating: 150mA; Forward Current: 150mA; Packaging: Tape and Reel; Number of Pins: 2; Package Quantity: 3000; Max Operating Temperature: 150°C; Min Operating Temperature: -65°C; Average Rectified Current: 150mA; Recovery Time: 4ns; Output Current: 150mA; Peak Non-Repetitive Surge Current: 2A; Width: 1.8mm; Voltage Rating (DC): 100V; Height: 1.2mm; Max Repetitive Reverse Voltage (Vrrm): 100V; Mount: Surface Mount; Length: 2.85mm
ENC1 = CMP-07421-000041-1: ROTARY ENCODER MECHANICAL 24PPR; Built in Switch: Yes; Hole Diameter: 1mm; Number of Channels: 2; Pulses per Revolution: 24; Output Type: Quadrature; Height: 13.4mm; Mount: Through Hole; RoHS Compliant: Yes; Orientation: Vertical; Length: 13.4mm; Encoder Type: Mechanical; Termination: PC Pin; Series: PEC12R; Min Operating Temperature: -30°C; Detent: Yes; REACH SVHC: No SVHC; Package Quantity: 75; Max Operating Temperature: 70°C; Packaging: Bulk; Width: 12.5mm
R9 R10 = CMP-2002-07915-3: RES 10K OHM 5% 1/16W 0402; Max Power Dissipation: 63mW; Temperature Coefficient: 100ppm/°C; Power Rating: 62.5mW; Voltage Rating: 50V; Size Code: 0402; Resistance Tolerance: 5%; Packaging: Tape and Reel; Case Code (Metric): 1005; Lead Free: Lead Free; Resistor Type: Thick Film; Min Operating Temperature: -55°C; Military Standard: Not; Depth: 0.5mm; Series: RC; Case/Package: 0402; Construction: Rectangular; Number of Terminations: 2; Package Quantity: 1; Termination: SMD/SMT; Length: 0.039inch; Case Code (Imperial): 0402; Height: 0.016inch; Features: Moisture Resistant; RoHS Compliant: Yes; Max Operating Temperature: 155°C; Tolerance: 5%; Width: 0.02inch
SW SW1-SW66 = CMP-037-000000-5: Cherry Switch 1U; Value: CherryMX; Design Item ID: CherryMX; Source: CherryMX.SchLib

## Nets that join several sheets
GND: Keyboard (35 pins), Matrix (5 pins)
COL_15: Keyboard (U2.35), Matrix (6 pins)
GPIO0: Keyboard (U2.2), Matrix (16 pins)
GPIO1: Keyboard (U2.3), Matrix (15 pins)
GPIO2: Keyboard (U2.4), Matrix (14 pins)
GPIO3: Keyboard (U2.5), Matrix (14 pins)
GPIO4: Keyboard (U2.6), Matrix (10 pins)
GPIO5: Keyboard (U2.7), Matrix (5 pins)
GPIO6: Keyboard (U2.8), Matrix (5 pins)
GPIO7: Keyboard (U2.9), Matrix (5 pins)
GPIO8: Keyboard (U2.11), Matrix (SW3.2 SW17.2 SW32.2 SW46.2)
GPIO9: Keyboard (U2.12), Matrix (SW4.2 SW18.2 SW33.2 SW47.2)
GPIO10: Keyboard (U2.13), Matrix (SW5.2 SW19.2 SW34.2 SW48.2)
GPIO11: Keyboard (U2.14), Matrix (5 pins)
GPIO16: Keyboard (U2.27), Matrix (SW7.2 SW21.2 SW36.2 SW50.2)
GPIO17: Keyboard (U2.28), Matrix (SW8.2 SW22.2 SW37.2 SW51.2)
GPIO18: Keyboard (U2.29), Matrix (5 pins)
GPIO19: Keyboard (U2.30), Matrix (5 pins)
GPIO20: Keyboard (U2.31), Matrix (5 pins)
GPIO21: Keyboard (U2.32), Matrix (5 pins)
GPIO22: Keyboard (U2.34), Matrix (SW13.2 SW27.2 SW65.2)
GPIO24: Keyboard (U2.36), Matrix (C20.1 R9.2)
GPIO25: Keyboard (U2.37), Matrix (C21.2 R10.2)